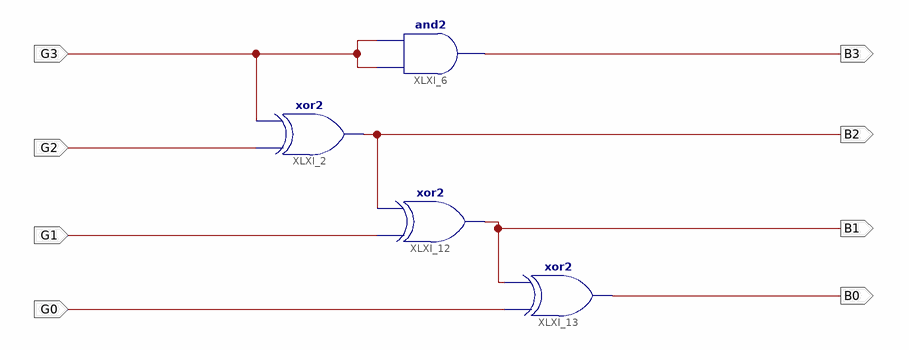
[diagram p0: schematic sheet 1]
// Xilinx ISE schematic GrayToBinaryModule.sch (spartan3e) as structural Verilog: 4 symbols, 8 ports
module GrayToBinaryModule (
  input  G0,
  input  G1,
  input  G2,
  input  G3,
  output B3,
  output B1,
  output B2,
  output B0
);

  and XLXI_6 (B3, G3, G3);
  xor XLXI_2 (B2, G2, G3);
  xor XLXI_12 (B1, G1, B2);
  xor XLXI_13 (B0, G0, B1);
endmodule
